# EAGLE design Car_0 (EAGLE 9.3.1)
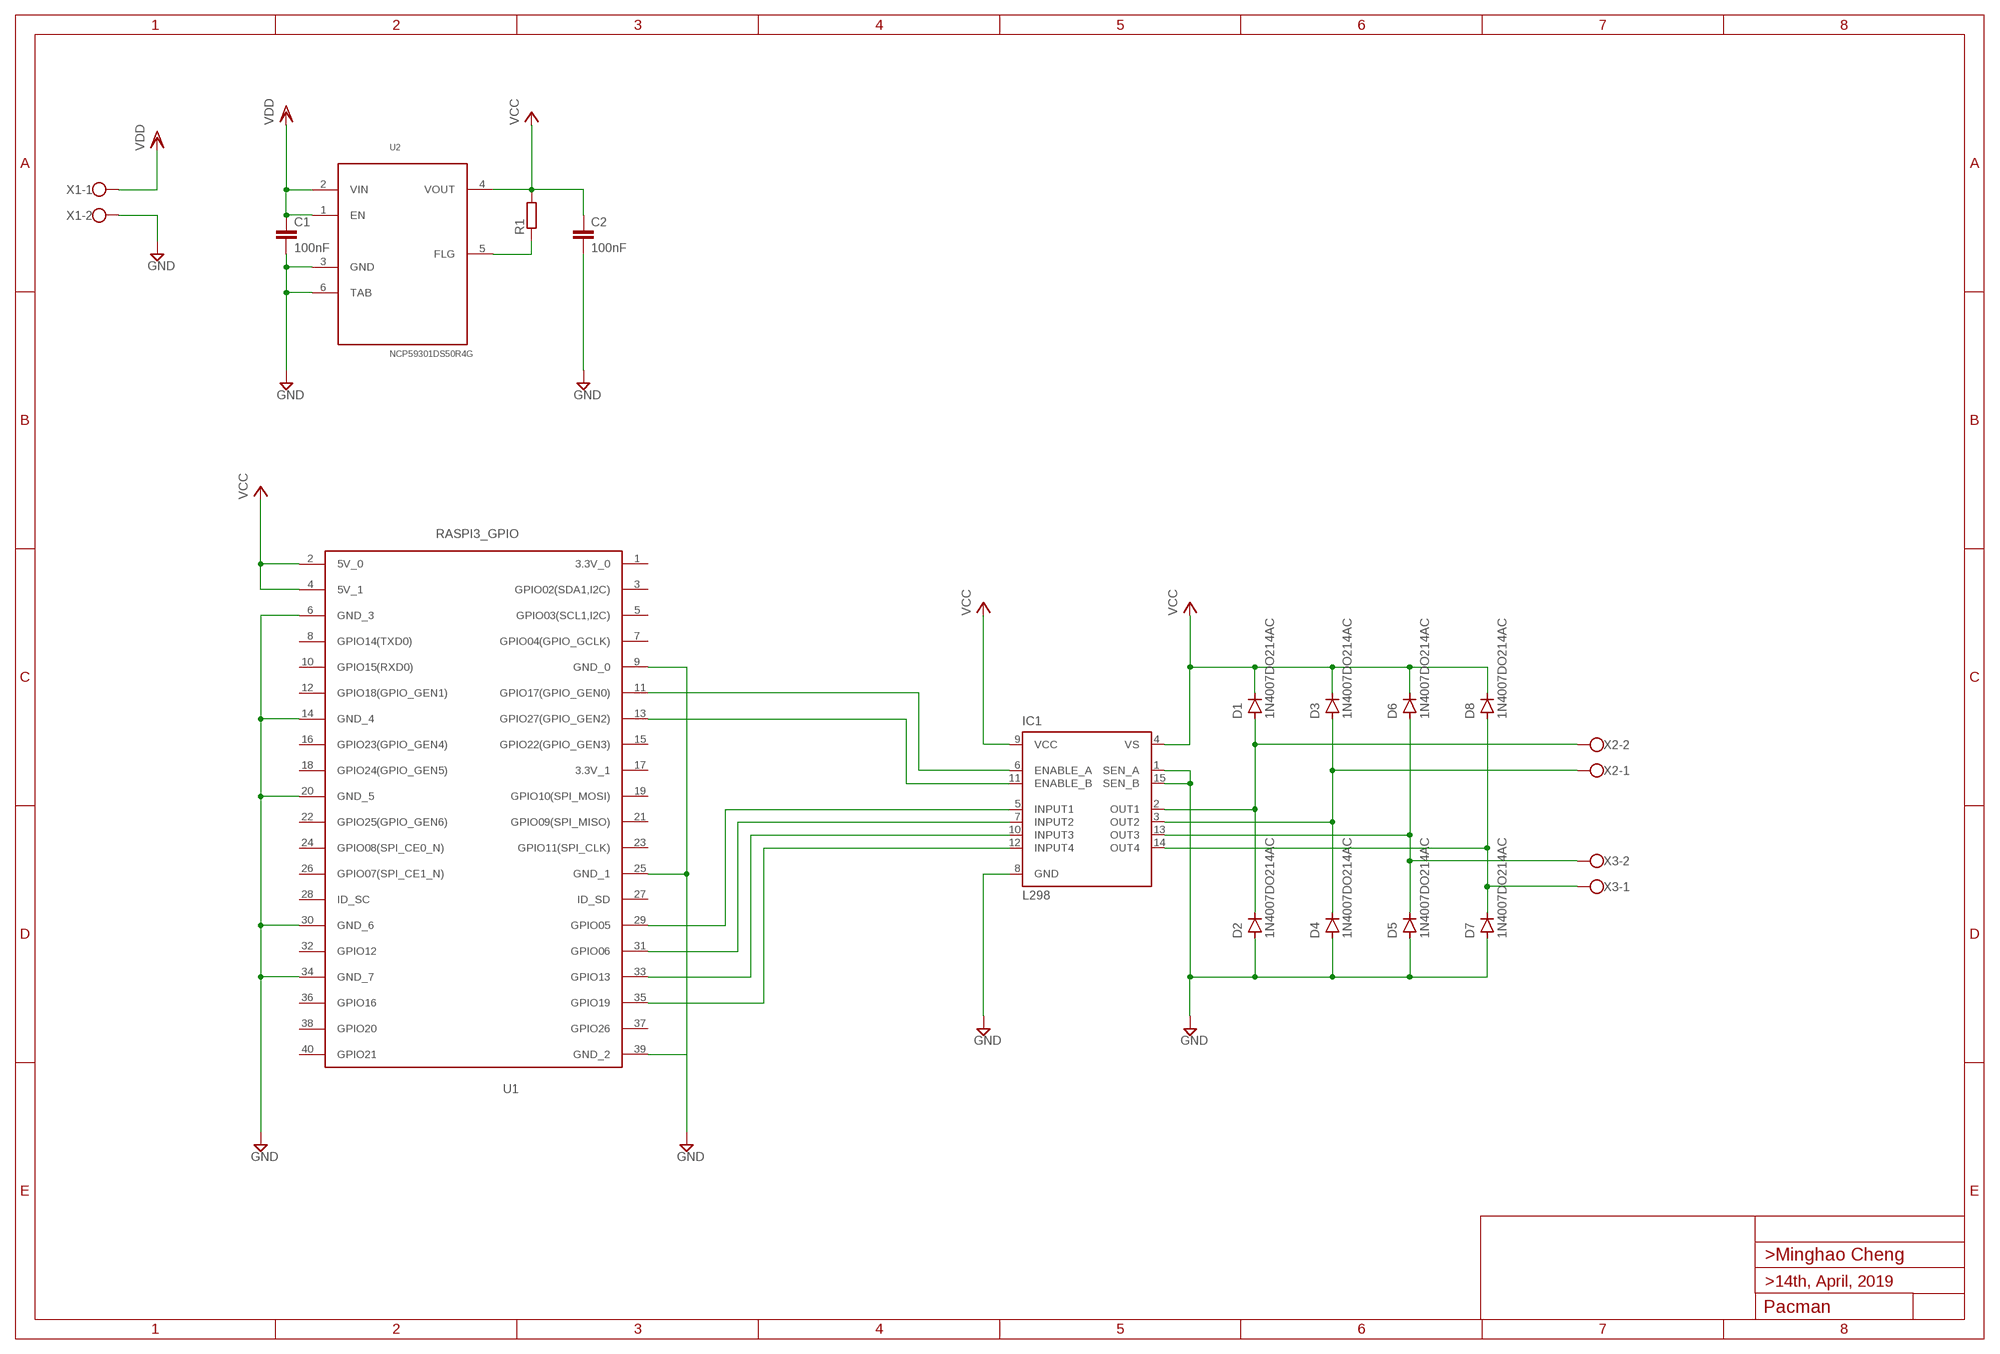
[diagram p0: schematic, sheet 1]

## Parts
C1  100nF  C-EUC0805  [C0805]
C2  100nF  C-EUC0805  [C0805]
D1  1N4007DO214AC  [SMA-DO214AC]
D2  1N4007DO214AC  [SMA-DO214AC]
D3  1N4007DO214AC  [SMA-DO214AC]
D4  1N4007DO214AC  [SMA-DO214AC]
D5  1N4007DO214AC  [SMA-DO214AC]
D6  1N4007DO214AC  [SMA-DO214AC]
D7  1N4007DO214AC  [SMA-DO214AC]
D8  1N4007DO214AC  [SMA-DO214AC]
IC1  L298  [MULTIWATT-15]
R1  R-EU_R0805  [R0805]
U1  RASPI3_GPIO  [FE20-2]
U2  NCP59301DS50R4G  [TO263-5]
X1  W237-102  [W237-102]
X2  W237-102  [W237-102]
X3  W237-102  [W237-102]

## Nets
GND: C1.2 C2.2 D2.A D4.A D5.A D7.A IC1.1(SEN_A) IC1.8(GND) IC1.15(SEN_B) U1.6(GND_3) U1.9(GND_0) U1.14(GND_4) U1.20(GND_5) U1.25(GND_1) U1.30(GND_6) U1.34(GND_7) U1.39(GND_2) U2.3(GND) U2.6(TAB) X1.2
N$1: D1.A D2.K(C) IC1.2(OUT1) X2.2
N$2: D3.A D4.K(C) IC1.3(OUT2) X2.1
N$3: D5.K(C) D6.A IC1.13(OUT3) X3.2
N$4: D7.K(C) D8.A IC1.14(OUT4) X3.1
N$5: IC1.6(ENABLE_A) U1.11(GPIO17(GPIO_GEN0))
N$6: IC1.11(ENABLE_B) U1.13(GPIO27(GPIO_GEN2))
N$7: IC1.5(INPUT1) U1.29(GPIO05)
N$8: IC1.7(INPUT2) U1.31(GPIO06)
N$9: IC1.10(INPUT3) U1.33(GPIO13)
N$10: IC1.12(INPUT4) U1.35(GPIO19)
N$11: R1.1 U2.5(FLG)
VCC: C2.1 D1.K(C) D3.K(C) D6.K(C) D8.K(C) IC1.4(VS) IC1.9(VCC) R1.2 U1.2(5V_0) U1.4(5V_1) U2.4(VOUT)
VDD: C1.1 U2.1(EN) U2.2(VIN) X1.1
Unconnected: U1.1(3.3V_0) U1.3(GPIO02(SDA1,I2C)) U1.5(GPIO03(SCL1,I2C)) U1.7(GPIO04(GPIO_GCLK)) U1.8(GPIO14(TXD0)) U1.10(GPIO15(RXD0)) U1.12(GPIO18(GPIO_GEN1)) U1.15(GPIO22(GPIO_GEN3)) U1.16(GPIO23(GPIO_GEN4)) U1.17(3.3V_1) U1.18(GPIO24(GPIO_GEN5)) U1.19(GPIO10(SPI_MOSI)) U1.21(GPIO09(SPI_MISO)) U1.22(GPIO25(GPIO_GEN6)) U1.23(GPIO11(SPI_CLK)) U1.24(GPIO08(SPI_CE0_N)) U1.26(GPIO07(SPI_CE1_N)) U1.27(ID_SD) U1.28(ID_SC) U1.32(GPIO12) U1.36(GPIO16) U1.37(GPIO26) U1.38(GPIO20) U1.40(GPIO21)

## Library data of the parts
C1 C2 = rcl:C-EU: CAPACITOR, European symbol; SPICEPREFIX: C
D1-D8 = PacMan:1N4007
IC1 = st-microelectronics:L298: DUAL FULL-BRIDGE DRIVER; MPN: L298N; OC_FARNELL: 1589425; OC_NEWARK: 32M1527
R1 = rcl:R-EU_: RESISTOR, European symbol; SPICEPREFIX: R
U1 = PacMan:RASPI3_GPIO
U2 = PacMan:NCP59301DS50R4G
X1-X3 = con-wago-500:W237-102: WAGO SCREW CLAMP; MPN: 237-102; OC_FARNELL: unknown; OC_NEWARK: 70K9898

## Board
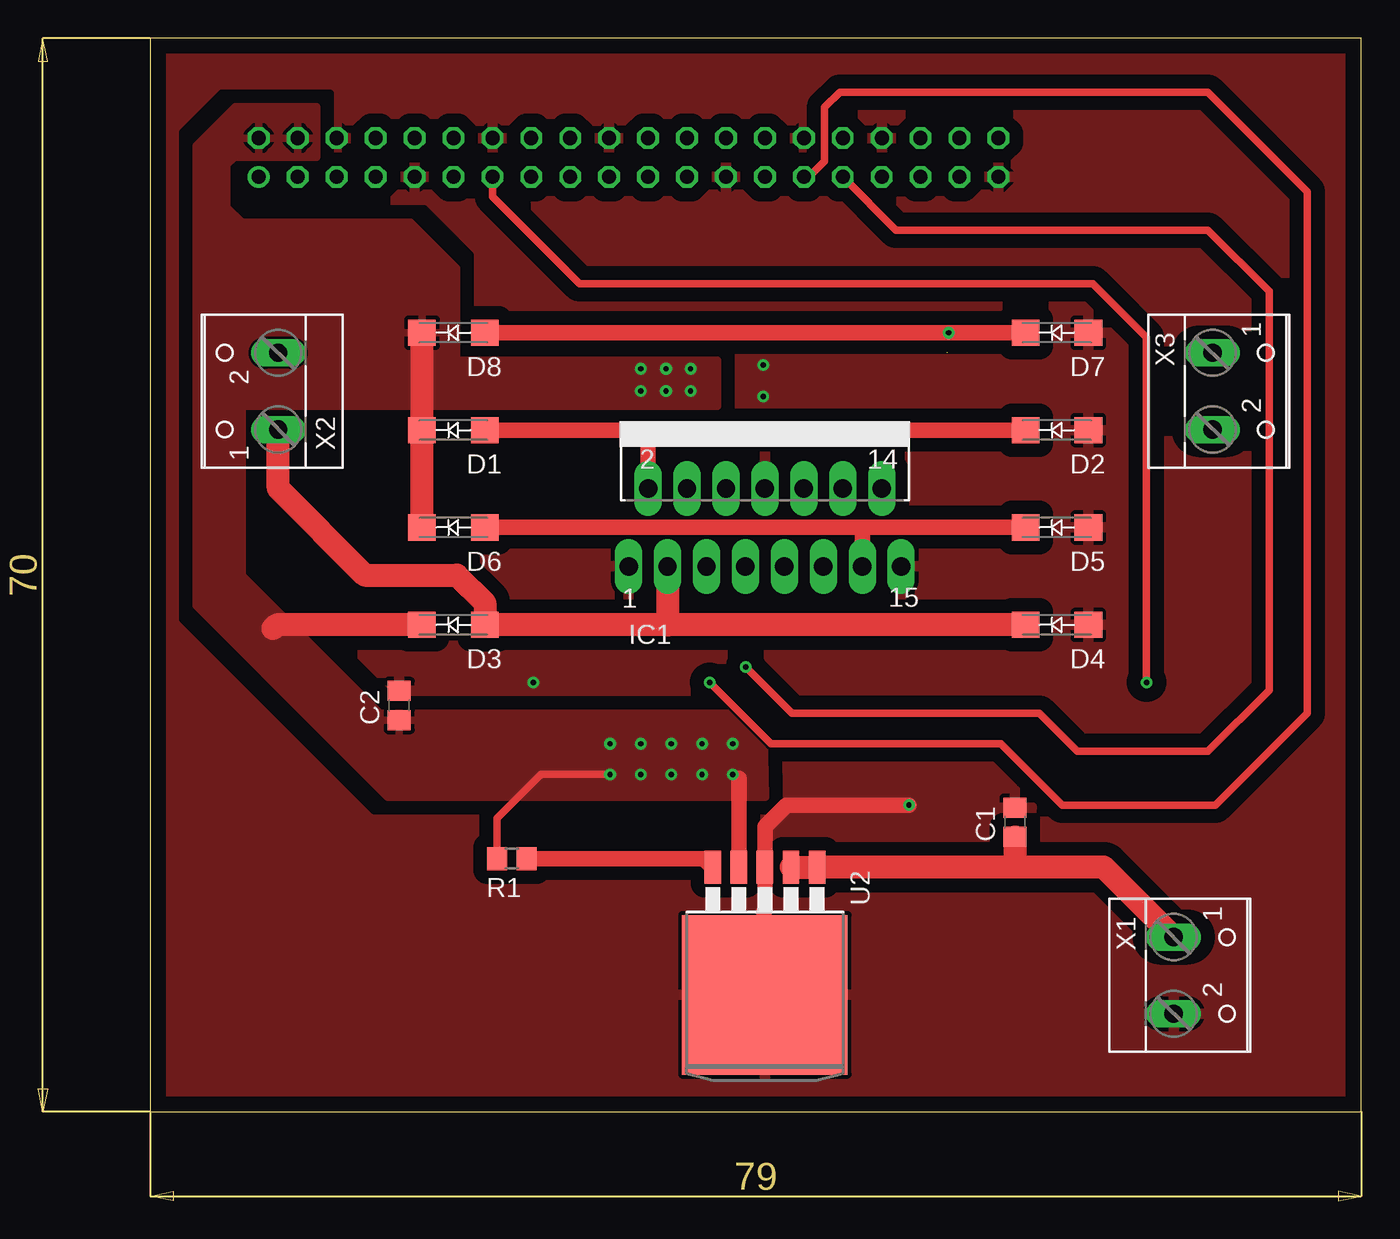
[diagram p1: board, top side]
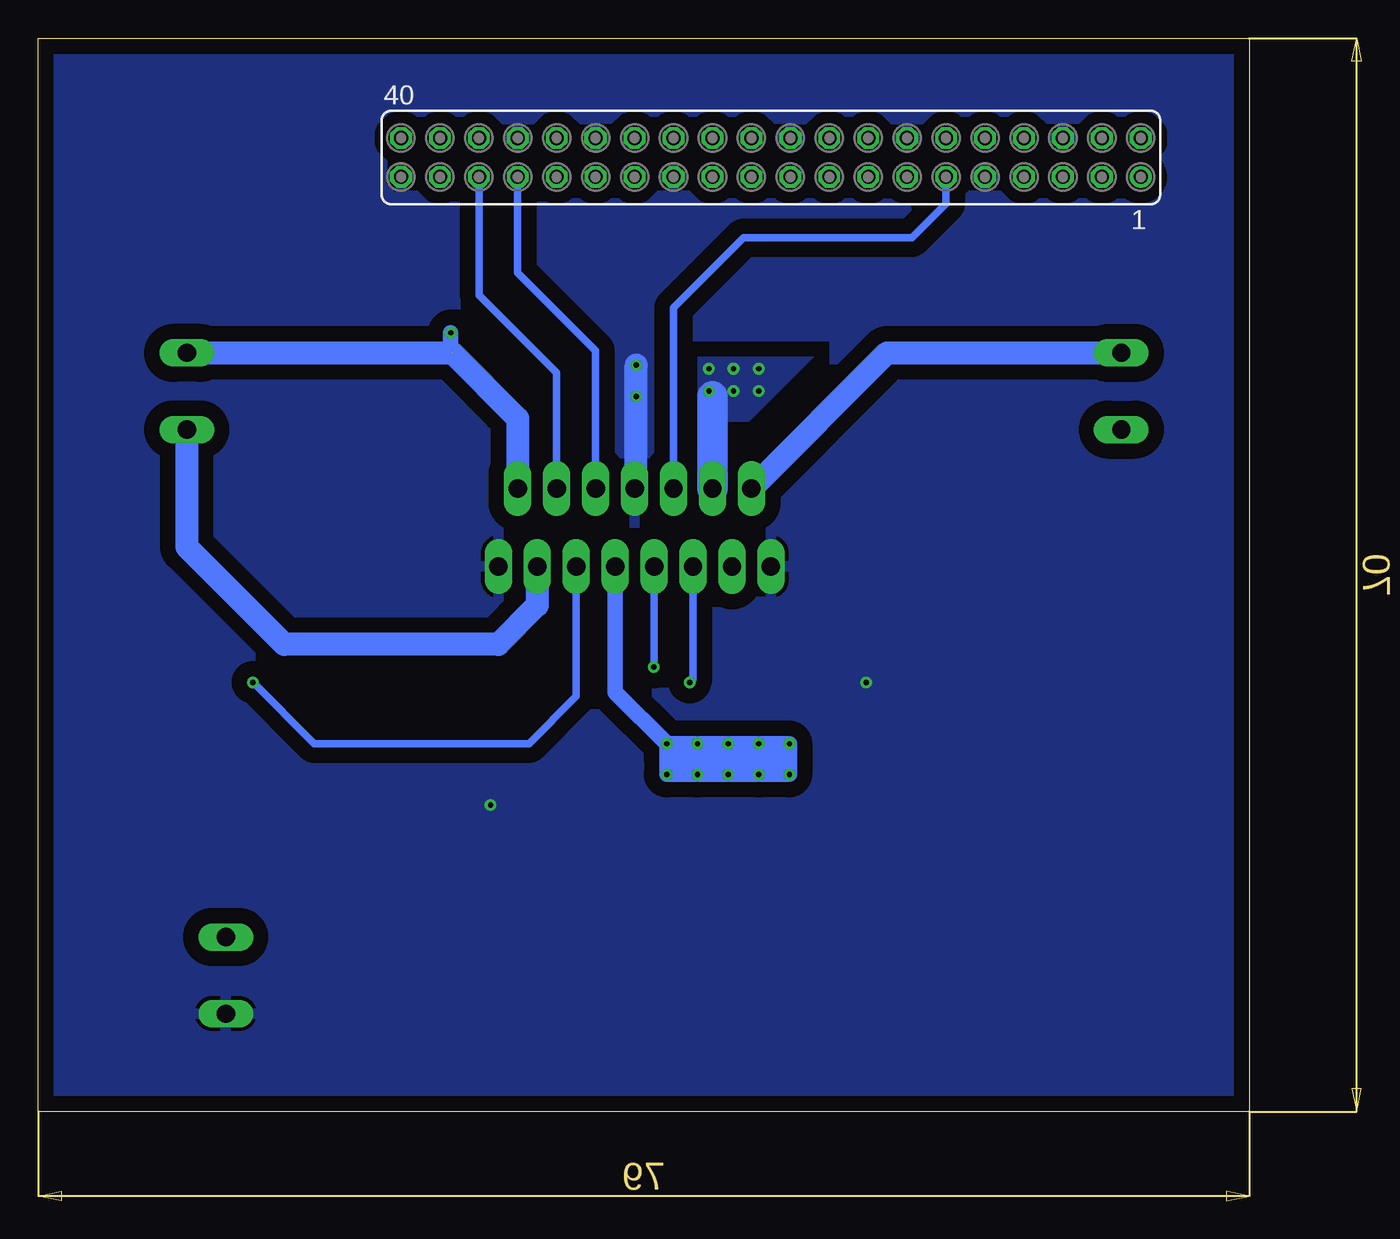
[diagram p2: board, bottom side, seen from below]

Size 79 x 70 mm. Coordinates in mm from the lower left corner, seen from the top.
Outline: 0,0 79,0 79,70 0,70 0,0
Copper layers (1*16): Top 0.035mm / dielectric 1.5mm / Bottom 0.035mm
Design rules "default": minimum track width 6mil, minimum drill 0.35mm, track to track 6mil, track to pad 6mil, pad to pad 6mil, via to via 6mil, smd to smd 6mil, copper to edge 40mil, drill to drill 6mil, minimum pad ring 10mil, minimum via ring 8mil, stop-mask expansion 4mil, vias tented up to drill 0mil, thermal gap 10mil

### Footprints (pad centres in the part's own frame; a part is rotated, then mirrored left to right if it is on the bottom)
C0805 = smd 1.3 x 1.5: 1 -0.95,0; 2 0.95,0
SMA-DO214AC = smd 1.8 x 1.7: A -2.05,0; K 2.05,0
MULTIWATT-15 = drill 1.2 long: 1 -8.89,-7.62; 2 -7.62,-2.54; 3 -6.35,-7.62; 4 -5.08,-2.54; 5 -3.81,-7.62; 6 -2.54,-2.54; 7 -1.27,-7.62; 8 0,-2.54; 9 1.27,-7.62; 10 2.54,-2.54; 11 3.81,-7.62; 12 5.08,-2.54; 13 6.35,-7.62; 14 7.62,-2.54; 15 8.89,-7.62
R0805 = smd 1.3 x 1.5: 1 -0.95,0; 2 0.95,0
FE20-2 = drill 0.914: 1 -24.13,1.27 | drill 0.914 octagon: 2 -24.13,-1.27; 3 -21.59,1.27; 4 -21.59,-1.27; 5 -19.05,1.27; 6 -19.05,-1.27; 7 -16.51,1.27; 8 -16.51,-1.27; 9 -13.97,1.27; 10 -13.97,-1.27; 11 -11.43,1.27; 12 -11.43,-1.27; 13 -8.89,1.27; 14 -8.89,-1.27; 15 -6.35,1.27; 16 -6.35,-1.27; 17 -3.81,1.27; 18 -3.81,-1.27; 19 -1.27,1.27; 20 -1.27,-1.27; 21 1.27,1.27; 22 1.27,-1.27; 23 3.81,1.27; 24 3.81,-1.27; 25 6.35,1.27; 26 6.35,-1.27; 27 8.89,1.27; 28 8.89,-1.27; 29 11.43,1.27; 30 11.43,-1.27; 31 13.97,1.27; 32 13.97,-1.27; 33 16.51,1.27; 34 16.51,-1.27; 35 19.05,1.27; 36 19.05,-1.27; 37 21.59,1.27; 38 21.59,-1.27; 39 24.13,1.27; 40 24.13,-1.27
TO263-5 = smd 1.067 x 2.159: 1 -3.404,-5.791; 2 -1.702,-5.791; 3 0,-5.791; 4 1.702,-5.791; 5 3.404,-5.791 | smd 10.8 x 10.41: 6 0,2.54
W237-102 = drill 1.194 long: 1 -2.5,-1.27; 2 2.5,-1.27

### Placement (x,y rotation side)
C1  56.41,18.88 90 top
C2  16.24,26.49 90 top
D1  19.78,44.45 180 top
D2  59.15,44.45 180 top
D3  19.78,31.75 180 top
D4  59.15,31.75 180 top
D5  59.15,38.1 180 top
D6  19.78,38.1 180 top
D7  59.15,50.8 180 top
D8  19.78,50.8 180 top
IC1  40.1,43.18 0 top
R1  23.59,16.51 180 top
U1  31.21,62.23 180 bottom
U2  40.1,10.16 180 top
X1  68.04,8.89 270 top
X2  7.08,46.99 90 top
X3  70.58,46.99 270 top

### Tracks (layer width: path | path; a pad name or v marks a point on that pad's centre or on a via)
GND  (via drill 0.35)
  Top 1: 40,13 40.1,13.1 U2.3 40.1,18.6 41.5,20 v49.5,20
  Bottom 1.5: IC1.8 40,40.74 v40,48.7
  other vias: 40,46.65 25,28
  pour Bottom (isolate 1, rank 2): 0,70 0,0 79,0 79,70
  pour Top (isolate 0.9, rank 2): 0,70 0,0 79,0 79,70
N$1
  Top 1.016: D2.K 32.48,44.45 | 32.48,44.45 D1.A | IC1.2 32.48,44.45
  Bottom 1.5: IC1.2 23.63,49.49 19,49.49 X2.2
N$2
  Top 1.5: D4.K 33.75,31.75 | 33.75,31.75 D3.A 21.83,33.17 20,35 14,35 8.35,40.65 X2.1 | IC1.3 33.75,31.75
N$3
  Top 1.016: D5.K 46.45,38.1 | 46.45,38.1 D6.A | IC1.13 46.45,38.1
  Bottom 1.5: X3.2 69.31,36.83 62.96,30.48 48.99,30.48 46.45,33.02 IC1.13
N$4  (via drill 0.35)  (1 unrouted)
  Top 1.016: D7.K v52.1,50.8 D8.A
  Bottom 1: v52.1,50.8 52.1,49.59 52,49.49
  Bottom 1.5: X3.1 52,49.49 | 51.99,49.49 47.72,45.22 IC1.14
N$5
  Bottom 0.5: IC1.6 37.56,52.44 33,57 22,57 19.78,59.22 U1.11
N$6  (via drill 0.35)
  Top 0.5: v65,28 65,50.5 61.5,54 28,54 22.32,59.68 U1.13
  Bottom 0.5: IC1.11 43.91,27.09 47,24 61,24 v65,28
N$7  (via drill 0.35)
  Top 0.5: v36.5,28 40.5,24 55.5,24 59.5,20 69.5,20 75.5,26 75.5,60 69,66.5 45,66.5 44,65.5 44,62 42.96,60.96 U1.29
  Bottom 0.5: IC1.5 36.29,28.21 v36.5,28
N$8  (via drill 0.35)
  Top 0.5: v38.85,29 41.85,26 58,26 60.5,23.5 69,23.5 73,27.5 73,53.5 69,57.5 48.64,57.5 U1.31
  Bottom 0.5: IC1.7 38.83,29.02 v38.85,29
N$9
  Bottom 0.5: IC1.10 42.64,49.64 47.72,54.72 U1.33
N$10
  Bottom 0.5: IC1.12 45.18,48.18 50.26,53.26 U1.35
N$11
  Top 1: U2.5 36.14,16.51 R1.1
VCC  (via drill 0.35)
  Top 0.5: R1.2 22.64,19.14 25.5,22 v30,22
  Top 1.016: U2.4 38.4,21.75
  Top 1.5: D6.K D8.K D1.K | D3.K 8.25,31.75 8,31.5
  Bottom 0.5: 41.37,36.63 IC1.9
  Bottom 1: 38,23 v38,24 v30,24 30,23 | 38,23 v38,22 | 30,23 v30,22 | v30,22 v32,22 v32,24 | v38,22 v36,22 v36,24 | v30,22 v38,22 | v38,22 37,23 | 37,23 30,23 | 37,23 38,23
  Bottom 1.016: IC1.9 41.37,27.37 v38,24
  Bottom 2: IC1.4 35.02,46.67
  other vias: 34,22 34,24 35.25,47 32,48.45 32,47 33.65,48.45 33.65,47 35.25,48.45
  pour Top: 40.14,20.5 40,26 15,26 6,35 6,46 37,46 37,49 20,49 20,55 17,58 6,58 5,59 5,61.75 5.5,62.25 10.85,62.25 10.85,65.55 5.55,65.55 3,63 3,33 15.5,20.5
  pour Bottom (isolate 1, no thermals): 36,46 36,49 36,49.25 28.4,49.25 32.65,45 34,45 36,45
VDD
  Top 1.5: U2.2 U2.1 56,15.95 | X1.1 62.21,15.95 56,15.95 | C1.1 56.41,16.36 56,15.95